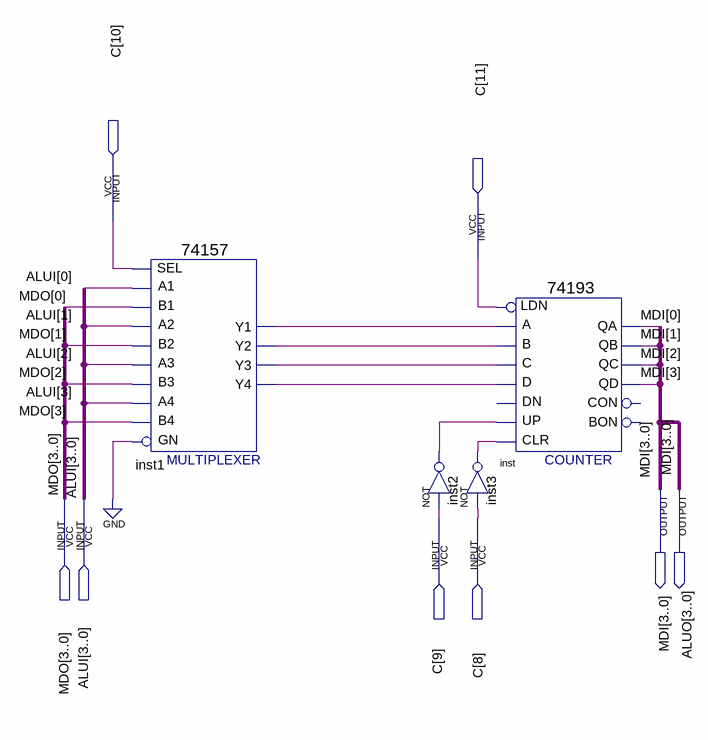
[diagram p0: schematic sheet]
// Quartus schematic ACC.bdf as structural Verilog: 4 symbols, 8 pins
module ACC (
  input  [11:8] C,
  input  [3:0] MDO,
  input  [3:0] ALUI,
  output [3:0] MDI,
  output [3:0] ALUO
);

  wire inst1_y1, inst1_y2, inst1_y3, inst1_y4, inst2_out, inst3_out;

  \74157  inst1 (
    .A1(ALUI[0]), .B1(MDO[0]), .SEL(C[10]), .B2(MDO[1]), .A3(ALUI[2]), .B3(MDO[2]), .A2(ALUI[1]),
    .B4(MDO[3]), .GN(1'b0), .A4(ALUI[3]), .Y2(inst1_y2), .Y1(inst1_y1), .Y4(inst1_y4), .Y3(inst1_y3));
  not inst2 (inst2_out, C[9]);
  \74193  inst (
    .D(inst1_y4), .C(inst1_y3), .B(inst1_y2), .A(inst1_y1), .CLR(inst3_out), .UP(inst2_out), .LDN(C[11]),
    .QB(ALUO[1]), .QA(ALUO[0]), .QD(ALUO[3]), .QC(ALUO[2]));  // open: DN, CON, BON
  not inst3 (inst3_out, C[8]);

  assign MDI = ALUO;
endmodule
